# EAGLE design RFID_Breakout (EAGLE 6.2)
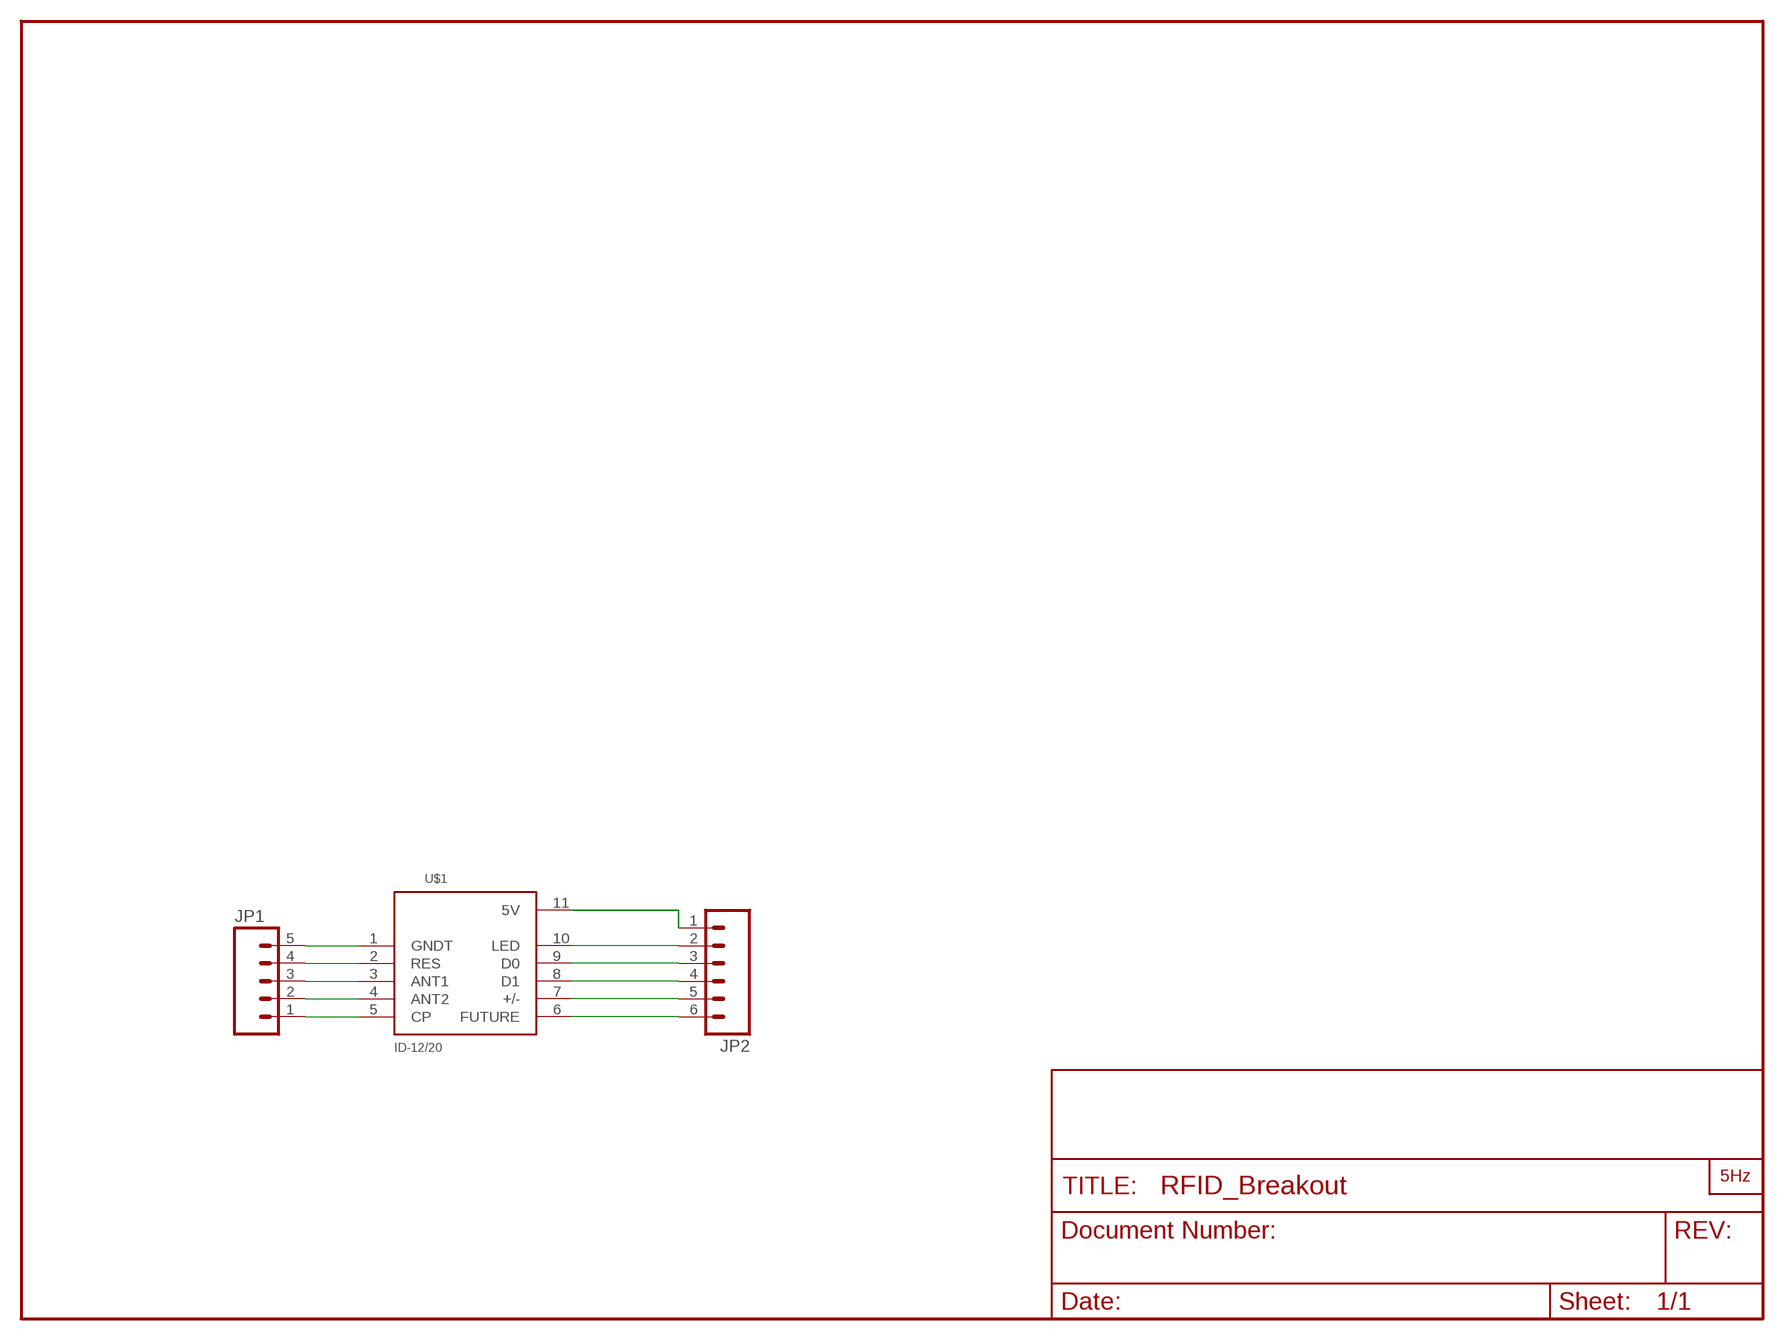
[diagram p0: schematic, sheet 1]

## Parts
JP1  M05PTH  [1X05]
JP2  M06SIP  [1X06]
U$1  ID-12/20  [ID-12]
U$2  LOGO2_SILK5MM  [LOGO2_5MM]

## Nets
5V: JP2.1 U$1.11(5V)
+/-: JP2.5 U$1.7(+/-)
ANT1: JP1.3 U$1.3(ANT1)
ANT2: JP1.2 U$1.4(ANT2)
CP: JP1.1 U$1.5(CP)
D0: JP2.3 U$1.9(D0)
D1: JP2.4 U$1.8(D1)
FUTURE: JP2.6 U$1.6(FUTURE)
GND: JP1.5 U$1.1(GNDT)
LED: JP2.2 U$1.10(LED)
RES: JP1.4 U$1.2(RES)

## Library data of the parts
JP1 = SparkFun:M05: Header 5 Standard 5-pin 0.1" header. Use with straight break away headers (SKU : PRT-00116), right angle break away headers (PRT-00553), swiss pins (PRT-00743), machine pins (PRT-00117), and female headers (PRT-00115). Molex polarized connector foot print use with SKU : PRT-08230 with associated crimp pins and housings.
JP2 = SparkFun:M06: Header 6 Standard 6-pin 0.1" header. Use with straight break away headers (SKU : PRT-00116), right angle break away headers (PRT-00553), swiss pins (PRT-00743), machine pins (PRT-00117), and female headers (PRT-00115). Molex polarized connector foot print use with SKU : PRT-08094 with associated crimp pins and housings. NOTES ON THE VARIANTS LOCK and LOCK_LONGPADS... This footprint was designed to help hold the alignment of a through-hole component (i.e. 6-pin header) while soldering it into place. You may notice that each hole has been shifted either up or down by 0.005 of an inch from it's more standard position (which is a perfectly straight line). This slight alteration caused the pins (the squares in the middle) to touch the edges of the holes. Because they are alternating, it causes a "brace" to hold the component in place. 0.005 has proven to be the perfect amount of "off-center" position when using our standard breakaway headers. Although looks a little odd when you look at the bare footprint, once you have a header in there, the alteration is very hard to notice. Also, if you push a header all the way into place, it is covered up entirely on the bottom side. This idea of altering the position of holes to aid alignment will be further integrated into the Sparkfun Library for other footprints. It can help hold any component with 3 or more connection pins.
U$1 = SparkFun:ID-12/20: ID2, ID12, and ID20 Package
U$2 = LOGO:LOGO2_SILK: PRINCIPAL

## Board
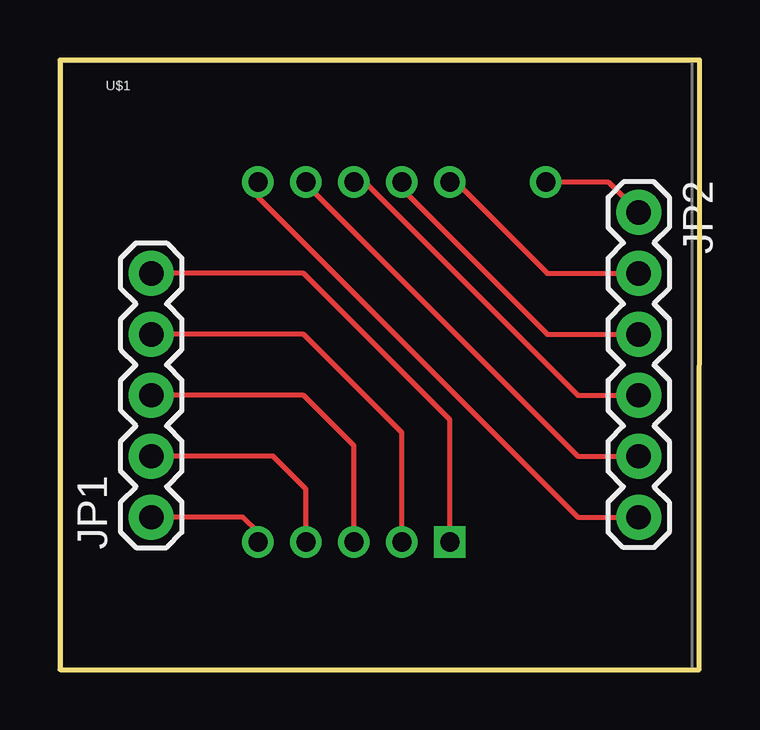
[diagram p1: board, top side]
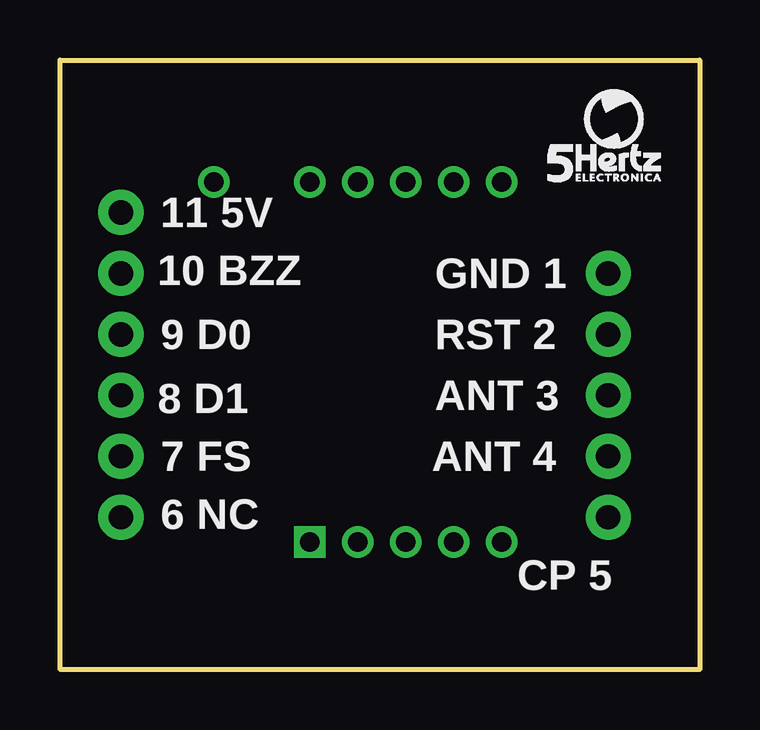
[diagram p2: board, bottom side, seen from below]

Size 26.67 x 25.4 mm. Coordinates in mm from the lower left corner, seen from the top.
Outline: 0,0 26.65,0 26.67,25.4 0,25.4 0,0
Copper layers (1*16): Top 0.035mm / dielectric 1.5mm / Bottom 0.035mm
Design rules: minimum track width 10mil, minimum drill 24mil, track to track 8mil, track to pad 8mil, pad to pad 8mil, via to via 8mil, smd to smd 8mil, copper to edge 40mil, drill to drill 8mil, minimum pad ring 10mil, minimum via ring 8mil, stop-mask expansion 4mil, vias tented up to drill 0mil, thermal gap 10mil

### Footprints (pad centres in the part's own frame; a part is rotated, then mirrored left to right if it is on the bottom)
1X05 = drill 1.016 pad 1.88: 1 0,0; 2 2.54,0; 3 5.08,0; 4 7.62,0; 5 10.16,0
1X06 = drill 1.016 pad 1.88: 1 0,0; 2 2.54,0; 3 5.08,0; 4 7.62,0; 5 10.16,0; 6 12.7,0
ID-12 = drill 0.8 square: 1 16.255,5.32 | drill 0.8: 2 14.255,5.32; 3 12.255,5.32; 4 10.255,5.32; 5 8.255,5.32; 6 8.255,20.32; 7 10.255,20.32; 8 12.255,20.32; 9 14.255,20.32; 10 16.255,20.32; 11 20.255,20.32

### Placement (x,y rotation side)
JP1  3.81,6.35 90 top
JP2  24.13,19.05 270 top
U$1  0,0 0 top
U$2  6.35,20.32 0 bottom

### Tracks (layer width: path | path; a pad name or v marks a point on that pad's centre or on a via)
5V
  Top 0.203: U$1.11 22.86,20.32 JP2.1
+/-
  Top 0.203: U$1.7 10.26,20.23 21.59,8.89 JP2.5
ANT1
  Top 0.203: U$1.3 12.26,9.34 10.16,11.43 JP1.3
ANT2
  Top 0.203: U$1.4 10.26,7.53 8.89,8.89 JP1.2
CP
  Top 0.203: U$1.5 8.26,5.71 7.62,6.35 JP1.1
D0
  Top 0.203: U$1.9 14.26,20.04 20.32,13.97 JP2.3
D1
  Top 0.203: U$1.8 12.7,20.32 21.59,11.43 JP2.4
FUTURE
  Top 0.203: U$1.6 8.26,19.68 21.59,6.35 JP2.6
GND
  Top 0.203: U$1.1 16.25,10.41 10.16,16.51 JP1.5
LED
  Top 0.203: U$1.10 16.51,20.32 20.32,16.51 JP2.2
RES
  Top 0.203: U$1.2 14.26,9.88 10.16,13.97 JP1.4

### Text on the board
bPlace: 11 5V | GND 1 | 10 BZZ | RST 2 | 9 D0 | ANT 3 | 8 D1 | ANT 4 | 7 FS | 6 NC | CP 5